# EAGLE schematic javamon-v3.0 (EAGLE 7.3.0)
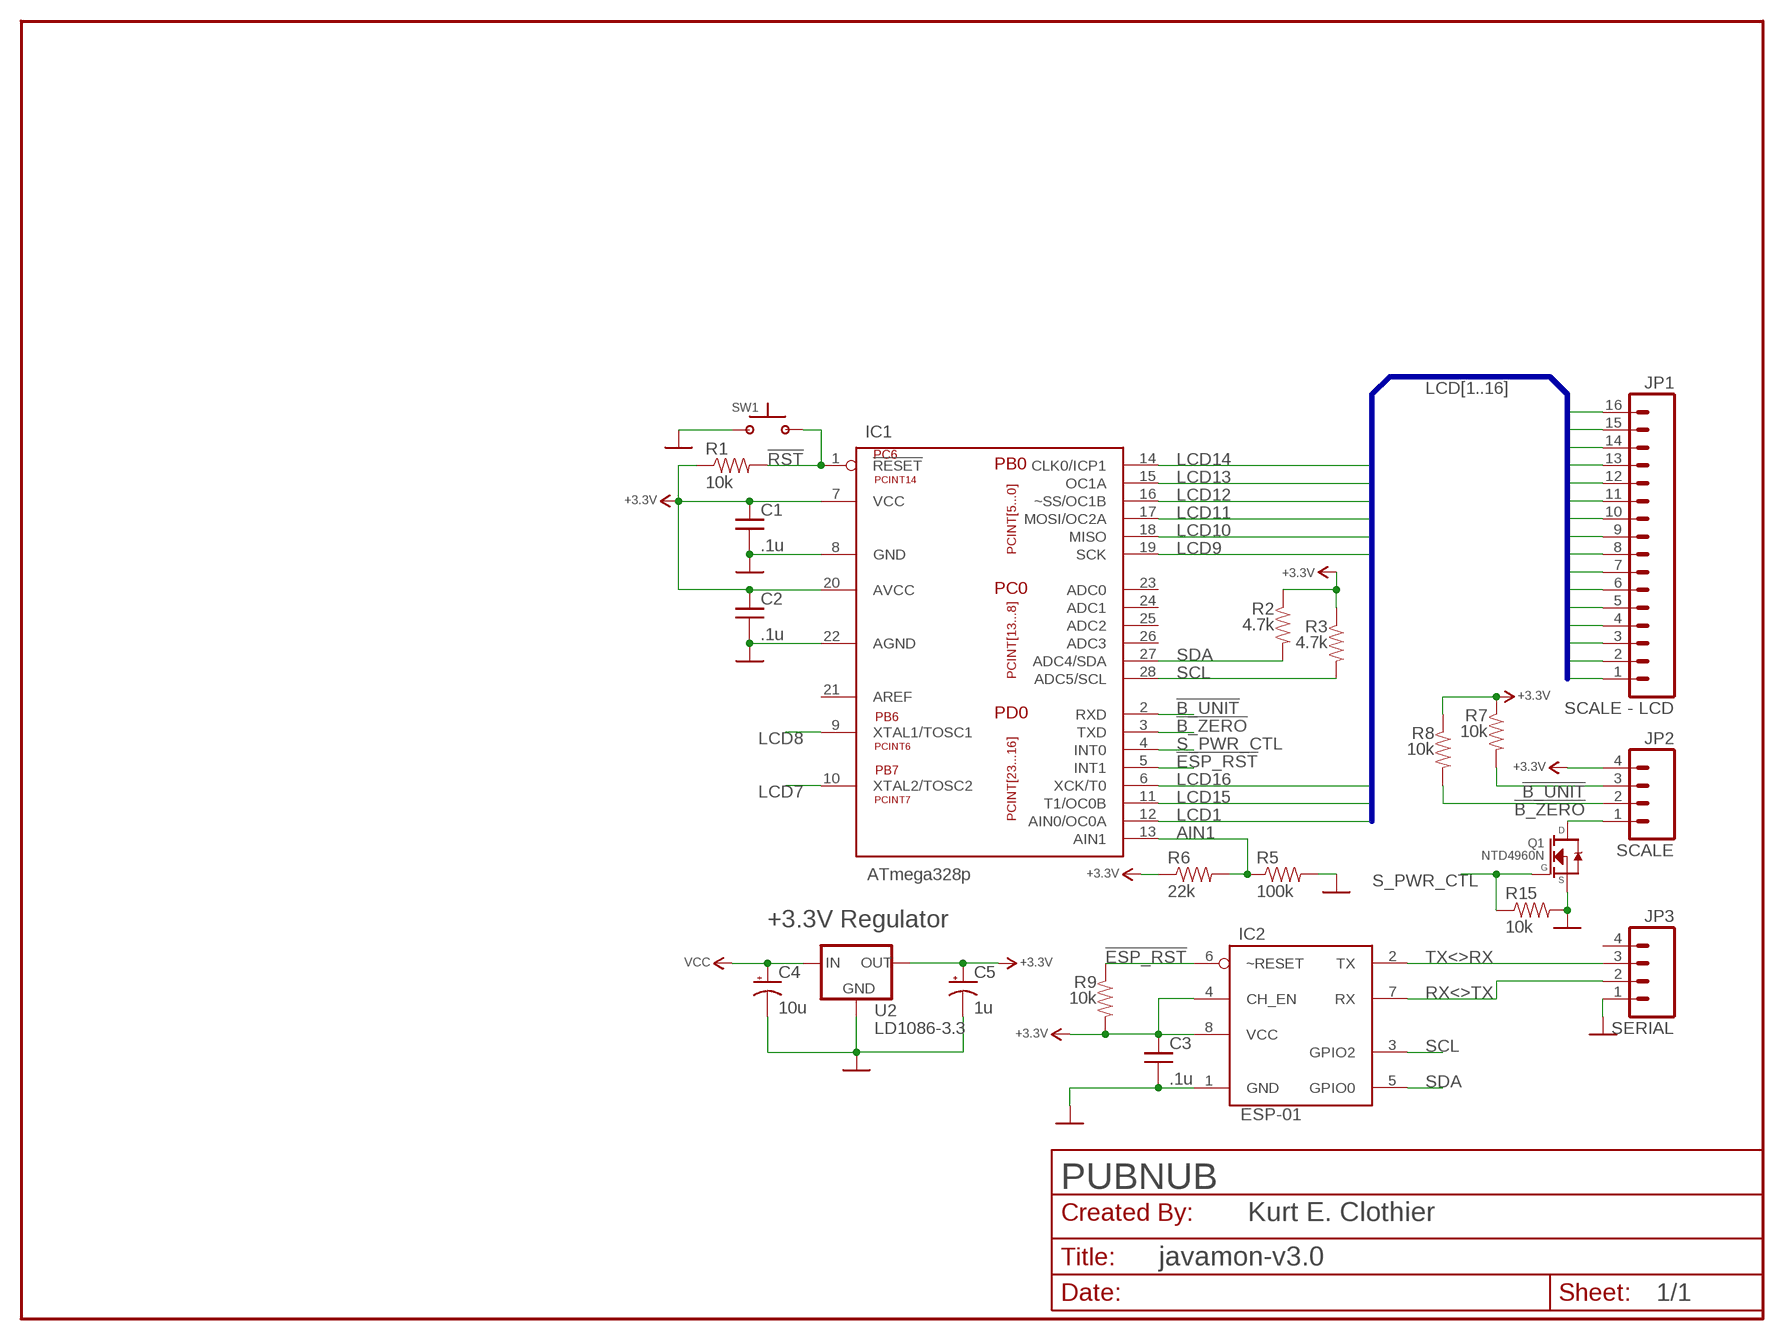
[diagram p0: schematic, sheet 1]

## Parts
C1  .1u  CAPACITOR-0805  [0805]
C2  .1u  CAPACITOR-0805  [0805]
C3  .1u  CAPACITOR-1206  [1206]
C4  10u  CAPACITOR-POL-1020  [CPOL_RADIAL-1020]
C5  1u  CAPACITOR-POL-1020  [CPOL_RADIAL-1020]
IC1  ATmega328p  MEGA48/88/168/328-PU-SOCKET  [28P3-SOCKET]
IC2  ESP-01  [2X04]
JP1  SCALE - LCD  M16LOCK_LONGPADS  [1X16_LOCK_LONGPADS]
JP2  SCALE  M04LOCK_LONGPADS  [1X04_LOCK_LONGPADS]
JP3  SERIAL  M04LOCK_LONGPADS  [1X04_LOCK_LONGPADS]
Q1  NTD4960N  NTD4960N-IPAK  [TO-251_(IPAK)]
R1  10k  RESISTOR-0805  [0805]
R2  4.7k  RESISTOR-V-0805  [0805]
R3  4.7k  RESISTOR-V-0805  [0805]
R5  100k  RESISTOR-0805  [0805]
R6  22k  RESISTOR-0805  [0805]
R7  10k  RESISTOR-V-0805  [0805]
R8  10k  RESISTOR-V-0805  [0805]
R9  10k  RESISTOR-V-1206  [1206]
R15  10k  RESISTOR-0805  [0805]
SW1  SPST_OFF-MOM-TACTILE-PTH  [TACTILE-PTH]
U2  LD1086-3.3  MCP1172-XX  [TO-92]

## Nets
!B_UNIT: IC1.2(RXD) JP2.3 R7.2
!B_ZERO: IC1.3(TXD) JP2.2 R8.2
!ESP_RST: IC1.5(INT1) IC2.6(~RESET) R9.1
!RST: IC1.1(!RESET) R1.2 SW1.3 SW1.4
+3.3V: C1.1 C2.1 C3.1 C5.1 IC1.7(VCC) IC1.20(AVCC) IC2.4(CH_EN) IC2.8(VCC) JP2.4 R1.1 R2.1 R3.1 R6.1 R7.1 R8.1 R9.2 U2.3(OUT)
AIN1: IC1.13(AIN1) R5.1 R6.2
GND-D: C1.2 C2.2 C3.2 C4.2 C5.2 IC1.8(GND) IC1.22(AGND) IC2.1(GND) JP3.1 Q1.3(S) R5.2 R15.2 SW1.1 SW1.2 U2.1(GND) ; supply symbol labelled GND-DIGITAL
LCD1: IC1.12(AIN0/OC0A) JP1.1
LCD2: JP1.2
LCD3: JP1.3
LCD4: JP1.4
LCD5: JP1.5
LCD6: JP1.6
LCD7: IC1.10(XTAL2/TOSC2) JP1.7
LCD8: IC1.9(XTAL1/TOSC1) JP1.8
LCD9: IC1.19(SCK) JP1.9
LCD10: IC1.18(MISO) JP1.10
LCD11: IC1.17(MOSI/OC2A) JP1.11
LCD12: IC1.16(~SS/OC1B) JP1.12
LCD13: IC1.15(OC1A) JP1.13
LCD14: IC1.14(CLK0/ICP1) JP1.14
LCD15: IC1.11(T1/OC0B) JP1.15
LCD16: IC1.6(XCK/T0) JP1.16
N$4: JP2.1 Q1.2(D)
RX<>TX: IC2.7(RX) JP3.2
S_PWR_CTL: IC1.4(INT0) Q1.1(G) R15.1
SCL: IC1.28(ADC5/SCL) IC2.3(GPIO2) R3.2
SDA: IC1.27(ADC4/SDA) IC2.5(GPIO0) R2.2
TX<>RX: IC2.2(TX)
VCC: C4.1 U2.2(IN)
Unconnected: IC1.21(AREF) IC1.23(ADC0) IC1.24(ADC1) IC1.25(ADC2) IC1.26(ADC3) JP3.3 JP3.4

## Buses
LCD[1..16]

## Notes on the sheet
- +3.3V Regulator

## Library data of the parts
C1-C3 = Passive Components:CAPACITOR: CAPACITOR - Vertical Alignment Basic schematic elements and footprints for non-polarized surface mount and through hole capacitors.
C4 C5 = Passive Components:CAPACITOR-POL: CAPACITOR - Vertical Alignment Basic schematic elements and footprints for polarized surface mount and through hole capacitors.
IC1 = Atmel:MEGA48/88/168/328-PU: Atmel AVR 28 Pin MICROCONTROLLER Data obtained from Atmel 8bit AVR.pdf ATmega48A/PA, ATmega88A/PA, ATmega168A/PA, ATmega328/P Featuers Include: 4/8/16/32 K Bytes FLASH 512/1K/1K/2K Bytes RAM 256/512/512/1K Bytes EEPROM USART, SPI, I2C 6-channel 10 bit ADC Two 8-bit Timers One 16-bit Timer Six PWM Channels 20 MHz 1.8 - 5.5 V Supply -40*C to 85*C Industrail Range Packages: 32A - 32-lead, Thin (1.0 mm) Plastic Quad Flat Package (TQFP) 28P3 - 28-lead, 0.300" Wide, Plastic Dual Inline Package (PDIP) 32M1-A - 32-pad, 5x5x1.0 body, Lead Picth 0.50 mm Wuad Flat No-Lead/Mirco Lead Frame Package (QFN/MLF) Created by Kurt E. Clothier, 3/24/2011 www.projectsbykec.com
IC2 = Hardware Modules:ESP-01: ESP-01 ESP8266 - v01/02 3.3V Tolerant 32bit SoC @ 80MHz / 160MHz TCP/IP Stack UART Communication 2 COnfigurable GPIO Kurt E. Clothier 6/2/62015
JP1 = Connectors:M16
JP2 JP3 = Connectors:M04: Header 4 Standard 4-pin 0.1" header. Use with straight break away headers (SKU : PRT-00116), right angle break away headers (PRT-00553), swiss pins (PRT-00743), machine pins (PRT-00117), and female headers (PRT-00115). Molex polarized connector foot print use with SKU : PRT-08231 with associated crimp pins and housings.
Q1 = Transistor-FET:NTD4960N: NTD4960N - N-Channel Enhancement Mode Power MOSFET Datasheet: http://www.onsemi.com/pub_link/Collateral/NTD4960N.PDF Characteristics: V_ds: 30V V_gs: 20V I_d: 45A P_d: 35.7W V_gs(th): 1.5V - 2.5V R_ds(on): 5 - 15 milliohms (V_gs > 4V) Created by Kurt E. Clothier; 4/30/2013 www.projectsbykec.com
R1 R5 R6 R15 = Passive Components:RESISTOR: RESISTOR - Horizontal Alignment Basic schematic elements and footprints for surface mount and through hole resistors.
R2 R3 R7-R9 = Passive Components:RESISTOR-V: RESISTOR - Vertical Alignment Basic schematic elements and footprints for surface mount and through hole resistors.
SW1 = Switches:SPST_OFF-MOM: Switch Circuit: Single Pole, Single Throw Function: OFF-MOM
U2 = PMIC:MCP1172-XX: Voltage Regulator